# EAGLE design test1 (EAGLE 7.2.0)
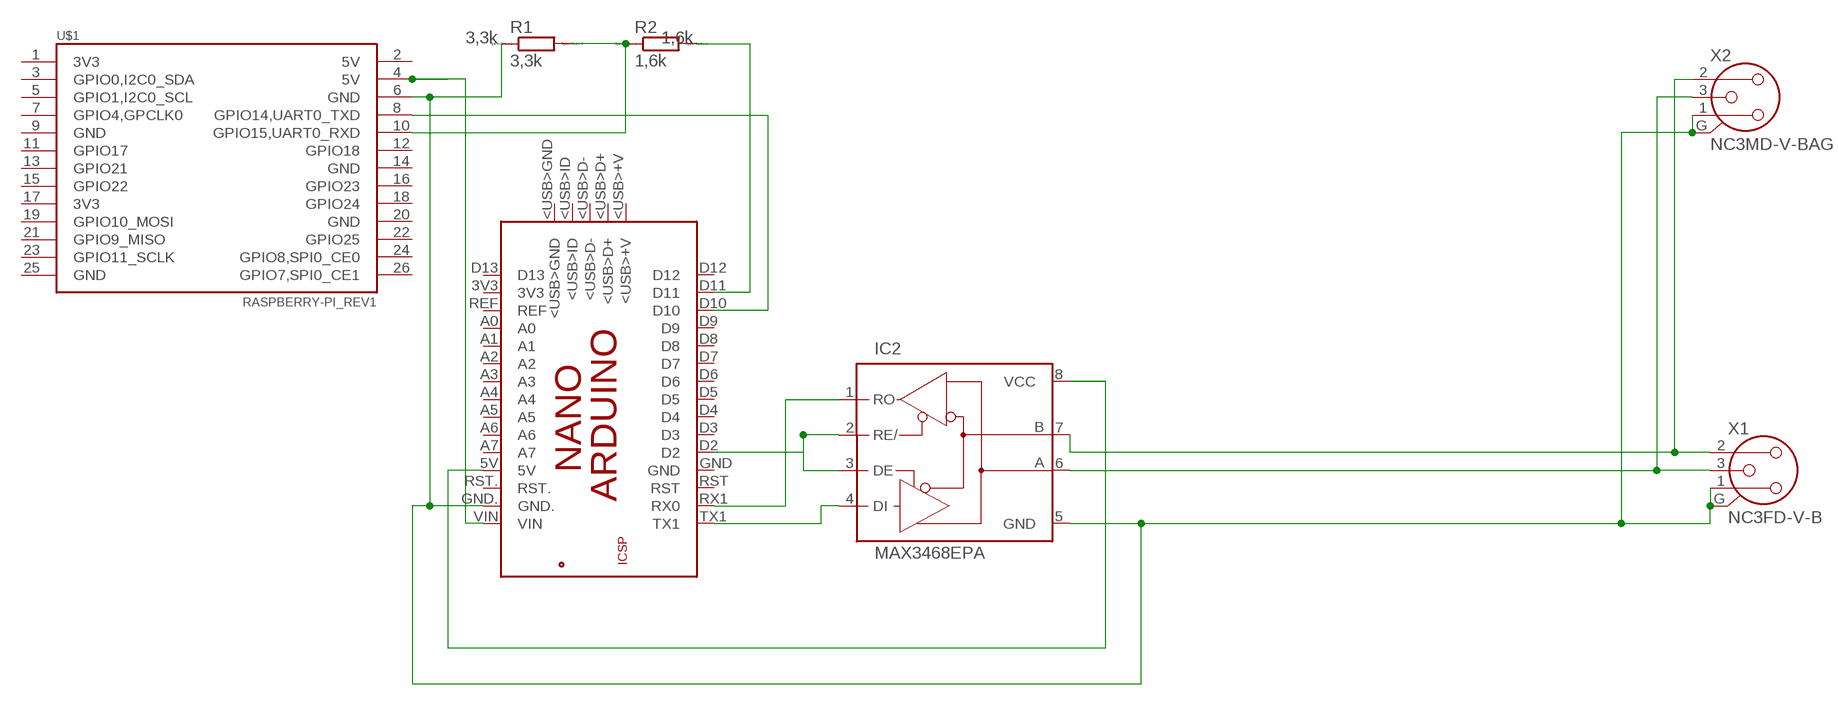
[diagram p0: schematic, sheet 1]

## Parts
IC2  MAX3468EPA  [DIL08]
PCB1  ARDUINO_NANO  [ARDUINO_NANO]
R1  3,3k  R0204/7  [0204/7]
R2  1,6k  R0204/7  [0204/7]
U$1  RASPBERRY-PI_REV1  [RASPBERRY-PI_REV1]
X1  NC3FD-V-B  [NC3FD-V-B]
X2  NC3MD-V-BAG  [NC3MD-V-BAG]

## Nets
N$1: IC2.4(DI) PCB1.TX1
N$2: IC2.2(RE/) IC2.3(DE) PCB1.D2
N$3: PCB1.VIN U$1.4(5V)
N$4: IC2.1(RO) PCB1.RX1(RX0)
N$5: IC2.7(B) X1.2 X2.2
N$9: IC2.6(A) X1.3 X2.3
N$10: PCB1.D11 R2.2
N$11: IC2.8(VCC) PCB1.5V
N$12: R1.2 R2.1 U$1.10(GPIO15,UART0_RXD)
N$13: IC2.5(GND) PCB1.GND. R1.1 U$1.6(GND) X1.1 X1.G X2.1 X2.G
N$14: PCB1.D10 U$1.8(GPIO14,UART0_TXD)
Unconnected: PCB1.3V3 PCB1.5V. PCB1.<USB>+V PCB1.<USB>D+ PCB1.<USB>D- PCB1.<USB>GND PCB1.<USB>ID PCB1.A0 PCB1.A1 PCB1.A2 PCB1.A3 PCB1.A4 PCB1.A5 PCB1.A6 PCB1.A7 PCB1.D3 PCB1.D4 PCB1.D5 PCB1.D6 PCB1.D7 PCB1.D8 PCB1.D9 PCB1.D12 PCB1.D13 PCB1.GND PCB1.GND_ PCB1.MISO PCB1.MOSI PCB1.REF PCB1.RESET.. PCB1.RST PCB1.RST. PCB1.SCK U$1.1(3V3) U$1.2(5V) U$1.3(GPIO0,I2C0_SDA) U$1.5(GPIO1,I2C0_SCL) U$1.7(GPIO4,GPCLK0) U$1.9(GND) U$1.11(GPIO17) U$1.12(GPIO18) U$1.13(GPIO21) U$1.14(GND) U$1.15(GPIO22) U$1.16(GPIO23) U$1.17(3V3) U$1.18(GPIO24) U$1.19(GPIO10_MOSI) U$1.20(GND) U$1.21(GPIO9_MISO) U$1.22(GPIO25) U$1.23(GPIO11_SCLK) U$1.24(GPIO8,SPI0_CE0) U$1.25(GND) U$1.26(GPIO7,SPI0_CE1)

## Library data of the parts
IC2 = maxim:MAX34*: +5V, Fail-Safe, 40Mbps, Profibus RS-485/RS-422 Transceivers Source: MAX3465-MAX3469.pdf; MPN: MAX3468EPA+; OC_FARNELL: unknown; OC_NEWARK: 78M5804
PCB1 = E14_Arduino_revB:ARDUINO_NANO: Device for representing an Arduino Nano board with a footprint in an EAGLE design. Created by Dave Young for Element14. More EAGLE documentation at: http://www.element14.com/community/community/knode/cadsoft_eagle
R1 = eagle-ltspice:R: RESISTOR, European symbol; SPICEMODEL: 3,3k; SPICEPREFIX: R
R2 = eagle-ltspice:R: RESISTOR, European symbol; SPICEMODEL: 1,6k; SPICEPREFIX: R
U$1 = RaspberryPi:RASPBERRY-PI_REV1: Raspberry Pi Board <http://www.raspberrypi.org/> Jacques Lagnel V1.0 (beta) 2012 Mateusz Bawaj V1.1 (beta) 2012 Board dimension: Forum 3D model <http://www.raspberrypi.org/forum/general-discussion/mechanical-profile-3d-models?value=3d%20model&type=1&include=1&search=1&ret=all> The GPIO Connector (P1): http://elinux.org/RPi_Low-level_peripherals
X1 = con-neutrik_ag:NC3: Neutrik Audio Connector XLR SERIES Stereo 1/4" jack Source: www.neutrik.com/; MF: NEUTRIK; MPN: NC3FD-V-B; OC_FARNELL: 5806150; OC_NEWARK: 27B4255
X2 = con-neutrik_ag:NC3: Neutrik Audio Connector XLR SERIES Stereo 1/4" jack Source: www.neutrik.com/; MF: NEUTRIK; MPN: NC3MD-V-BAG; OC_FARNELL: unknown; OC_NEWARK: 89F6040

## Board
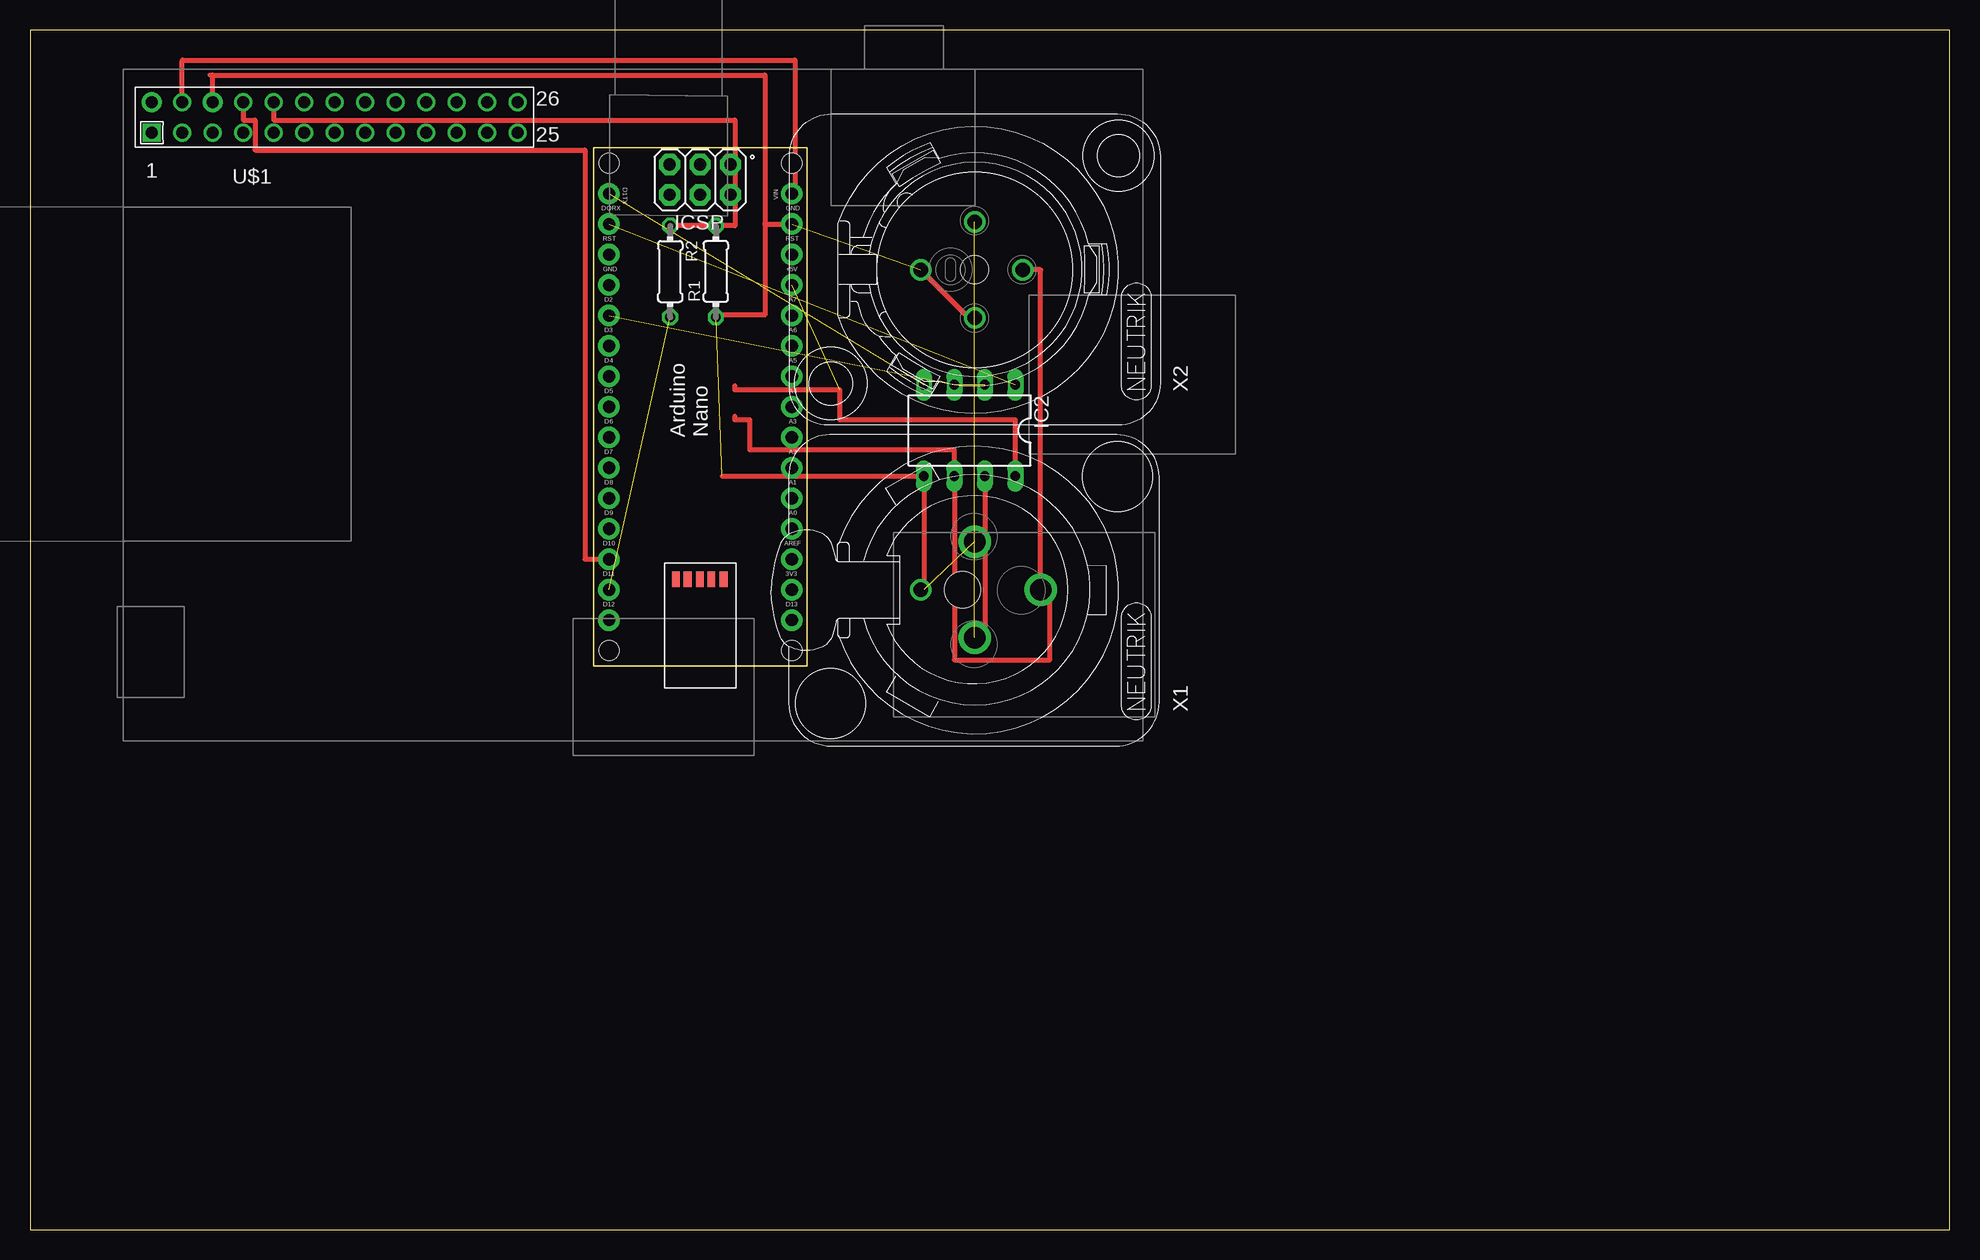
[diagram p1: board, top side]

Size 160 x 100 mm. Coordinates in mm from the lower left corner, seen from the top.
Outline: 0,0 160,0 160,100 0,100 0,0
Copper layers (1*16): Top 0.035mm / dielectric 1.5mm / Bottom 0.035mm
Design rules "default": minimum track width 10mil, minimum drill 24mil, track to track 8mil, track to pad 8mil, pad to pad 8mil, via to via 8mil, smd to smd 8mil, copper to edge 40mil, drill to drill 8mil, minimum pad ring 10mil, minimum via ring 8mil, stop-mask expansion 4mil, vias tented up to drill 0mil, thermal gap 10mil

### Footprints (pad centres in the part's own frame; a part is rotated, then mirrored left to right if it is on the bottom)
DIL08 = drill 0.813 long: 1 -3.81,-3.81; 2 -1.27,-3.81; 3 1.27,-3.81; 4 3.81,-3.81; 5 3.81,3.81; 6 1.27,3.81; 7 -1.27,3.81; 8 -3.81,3.81
ARDUINO_NANO = drill 1.016 pad 1.778: 3V3 6.35,1.27; 5V 31.75,1.27; A0 11.43,1.27; A1 13.97,1.27; A2 16.51,1.27; A3 19.05,1.27; A4 21.59,1.27; A5 24.13,1.27; A6 26.67,1.27; A7 29.21,1.27; D2 29.21,16.51; D3 26.67,16.51; D4 24.13,16.51; D5 21.59,16.51; D6 19.05,16.51; D7 16.51,16.51; D8 13.97,16.51; D9 11.43,16.51; D10 8.89,16.51; D11 6.35,16.51; D12 3.81,16.51; D13 3.81,1.27; GND 31.75,16.51; GND. 36.83,1.27; REF 8.89,1.27; RST 34.29,16.51; RST. 34.29,1.27; RX1 36.83,16.51; TX1 39.37,16.51; VIN 39.37,1.27 | drill 1.016 pad 1.778 octagon: 5V. 39.268,6.375; GND_ 39.268,11.455; MISO 41.808,6.375; MOSI 39.268,8.915; RESET.. 41.808,11.455; SCK 41.808,8.915 | smd 1.27 x 0.635: <USB>+V 7.214,10.947; <USB>D+ 7.214,9.957; <USB>D- 7.214,8.941; <USB>GND 7.214,6.96; <USB>ID 7.214,7.976 | hole 1.651: 1.27,1.27; 1.27,16.51; 41.91,16.51; 41.91,1.27
0204/7 = drill 0.813 octagon: 1 -3.81,0; 2 3.81,0
RASPBERRY-PI_REV1 = drill 1 square: 1 -41.91,21.59 | drill 1 pad 1.676: 2 -41.91,24.13; 6 -36.83,24.13 | drill 1: 3 -39.37,21.59; 4 -39.37,24.13; 5 -36.83,21.59; 7 -34.29,21.59; 8 -34.29,24.13; 9 -31.75,21.59; 10 -31.75,24.13; 11 -29.21,21.59; 12 -29.21,24.13; 13 -26.67,21.59; 14 -26.67,24.13; 15 -24.13,21.59; 16 -24.13,24.13; 17 -21.59,21.59; 18 -21.59,24.13; 19 -19.05,21.59; 20 -19.05,24.13; 21 -16.51,21.59; 22 -16.51,24.13; 23 -13.97,21.59; 24 -13.97,24.13; 25 -11.43,21.59; 26 -11.43,24.13
NC3FD-V-B = drill 1.8: 1 4,0; 2 -4,0; 3 0,-5.5 | drill 1.2: G 0,4.5 | hole 3: 0,1
NC3MD-V-BAG = drill 1.2: 1 -4,0; 2 4,0; 3 0,-4; G 0,4.5 | hole 2.3: 0,0

### Placement (x,y rotation side)
IC2  78.32,66.62 180 top
PCB1  64.77,46.99 90 top
R1  57.17,79.87 90 top
R2  53.36,79.87 270 top
U$1  52.07,69.85 0 top
X1  78.74,53.34 90 top
X2  78.74,80.01 90 top

### Tracks (layer width: path | path; a pad name or v marks a point on that pad's centre or on a via)
N$1  (1 unrouted)
N$2  (2 unrouted)
N$3
  Top 0.406: U$1.4 12.7,97.5 63.75,97.5 63.75,86.36 PCB1.VIN
N$4  (1 unrouted)
N$5  (1 unrouted)
  Top 0.406: IC2.7 79.59,49.34 X1.2
N$9
  Top 0.406: X2.3 84.24,80.01 X1.3 85,53.34 85,47.5 77.05,47.5 IC2.6 77.05,65 60,65 60,67.5 58.75,67.5 58.75,67.81
N$10  (1 unrouted)
N$11  (1 unrouted)
  Top 0.406: IC2.8 82.13,67.5 67.5,67.5 67.5,70 58.75,70 58.75,70.34
N$12
  Top 0.406: U$1.10 20.32,92.5 58.75,92.5 58.75,83.68 R1.2 R2.1
N$13  (3 unrouted)
  Top 0.406: X2.1 78.24,76.01 X2.G | U$1.6 15.24,96.25 | 15.24,96.25 15,96.25 | 15.24,96.25 61.25,96.25 61.25,83.82 | 61.25,83.82 PCB1.GND. | 61.25,83.82 61.25,76.25 57.17,76.25 R1.1 | 57.7,62.81 IC2.5 74.51,53.34 X1.G
N$14
  Top 0.406: U$1.8 17.78,92.5 18.75,92.5 18.75,90 46.25,90 46.25,55.88 PCB1.D10